# Altium schematic sheet Block Diagram.SchDoc: Block Diagram
size A3; CheckedBy: NA; DrawnBy: Deepak Reddy; Revision: 1.0.0; SheetNumber: 2; SheetTotal: 8
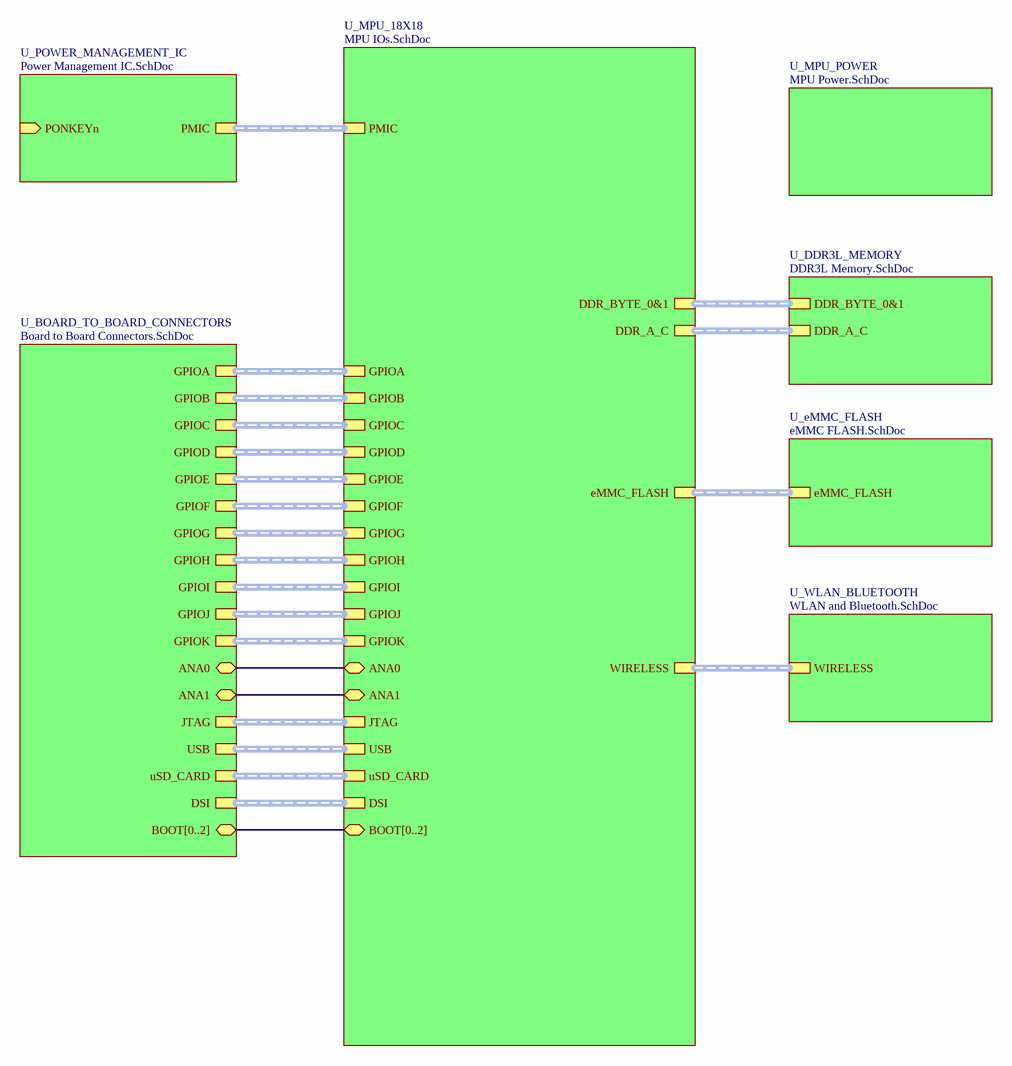
[diagram p0: Block Diagram.SchDoc]

## Sub-sheets
U_BOARD_TO_BOARD_CONNECTORS = Board to Board Connectors.SchDoc: GPIOA (harness GPIOA), GPIOC (harness GPIOC), GPIOB (harness GPIOB), GPIOD (harness GPIOD), ANA1 (bidir), GPIOF (harness GPIOF), GPIOI (harness GPIOI), JTAG (harness JTAG), USB (harness USB), DSI (harness DSI), GPIOK (harness GPIOK), GPIOG (harness GPIOG), GPIOH (harness GPIOH), BOOT[0..2] (bidir), ANA0 (bidir), GPIOE (harness GPIOE), uSD_CARD (harness uSD_CARD), GPIOJ (harness GPIOJ)
U_DDR3L_MEMORY = DDR3L Memory.SchDoc: DDR_BYTE_0&1 (harness DDR_BYTE_0&1), DDR_A_C (harness DDR_A_C)
U_eMMC_FLASH = eMMC FLASH.SchDoc: eMMC_FLASH (harness eMMC_FLASH)
U_MPU_18X18 = MPU IOs.SchDoc: GPIOD (harness GPIOD), ANA1 (bidir), GPIOF (harness GPIOF), DDR_BYTE_0&1 (harness DDR_BYTE_0&1), GPIOA (harness GPIOA), PMIC (harness PMIC), DDR_A_C (harness DDR_A_C), GPIOI (harness GPIOI), JTAG (harness JTAG), USB (harness USB), DSI (harness DSI), GPIOK (harness GPIOK), GPIOG (harness GPIOG), GPIOC (harness GPIOC), GPIOH (harness GPIOH), BOOT[0..2] (bidir), ANA0 (bidir), GPIOE (harness GPIOE), uSD_CARD (harness uSD_CARD), WIRELESS (harness WIRELESS), eMMC_FLASH (harness eMMC_FLASH), GPIOJ (harness GPIOJ), GPIOB (harness GPIOB)
U_MPU_POWER = MPU Power.SchDoc: no entries
U_POWER_MANAGEMENT_IC = Power Management IC.SchDoc: PMIC (harness PMIC), PONKEYn (in)
U_WLAN_BLUETOOTH = WLAN and Bluetooth.SchDoc: WIRELESS (harness WIRELESS)

## Nets
(unnamed): sheet U_MPU_18X18/ANA1, sheet U_BOARD_TO_BOARD_CONNECTORS/ANA1
(unnamed): sheet U_MPU_18X18/ANA0, sheet U_BOARD_TO_BOARD_CONNECTORS/ANA0

## Buses and harness runs
bus sheet U_BOARD_TO_BOARD_CONNECTORS/BOOT[0..2] = sheet U_MPU_18X18/BOOT[0..2]
harness sheet U_BOARD_TO_BOARD_CONNECTORS/DSI = sheet U_MPU_18X18/DSI
harness sheet U_BOARD_TO_BOARD_CONNECTORS/GPIOA = sheet U_MPU_18X18/GPIOA
harness sheet U_BOARD_TO_BOARD_CONNECTORS/GPIOB = sheet U_MPU_18X18/GPIOB
harness sheet U_BOARD_TO_BOARD_CONNECTORS/GPIOC = sheet U_MPU_18X18/GPIOC
harness sheet U_BOARD_TO_BOARD_CONNECTORS/GPIOD = sheet U_MPU_18X18/GPIOD
harness sheet U_BOARD_TO_BOARD_CONNECTORS/GPIOE = sheet U_MPU_18X18/GPIOE
harness sheet U_BOARD_TO_BOARD_CONNECTORS/GPIOF = sheet U_MPU_18X18/GPIOF
harness sheet U_BOARD_TO_BOARD_CONNECTORS/GPIOG = sheet U_MPU_18X18/GPIOG
harness sheet U_BOARD_TO_BOARD_CONNECTORS/GPIOH = sheet U_MPU_18X18/GPIOH
harness sheet U_BOARD_TO_BOARD_CONNECTORS/GPIOI = sheet U_MPU_18X18/GPIOI
harness sheet U_BOARD_TO_BOARD_CONNECTORS/GPIOJ = sheet U_MPU_18X18/GPIOJ
harness sheet U_BOARD_TO_BOARD_CONNECTORS/GPIOK = sheet U_MPU_18X18/GPIOK
harness sheet U_BOARD_TO_BOARD_CONNECTORS/JTAG = sheet U_MPU_18X18/JTAG
harness sheet U_BOARD_TO_BOARD_CONNECTORS/USB = sheet U_MPU_18X18/USB
harness sheet U_BOARD_TO_BOARD_CONNECTORS/uSD_CARD = sheet U_MPU_18X18/uSD_CARD
harness sheet U_DDR3L_MEMORY/DDR_A_C = sheet U_MPU_18X18/DDR_A_C
harness sheet U_DDR3L_MEMORY/DDR_BYTE_0&1 = sheet U_MPU_18X18/DDR_BYTE_0&1
harness sheet U_eMMC_FLASH/eMMC_FLASH = sheet U_MPU_18X18/eMMC_FLASH
harness sheet U_MPU_18X18/PMIC = sheet U_POWER_MANAGEMENT_IC/PMIC
harness sheet U_MPU_18X18/WIRELESS = sheet U_WLAN_BLUETOOTH/WIRELESS

## Notes on the sheet
- Title
- Size:
- Date:
- A3
- Revision:
- Project Name:
- Sheet:
- of
- Drawn By:
- Checked By:
- www.logicboards.org